# Altium schematic sheet Power_Circuit.SchDoc (part 2 of 3)
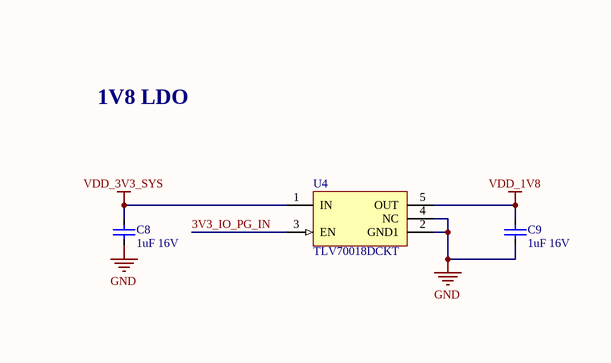
[diagram p2: Power_Circuit.SchDoc, right]
## Library data of the parts
C1 C8 C9 = 0603YD105KAT2A: 0603 1 uF 16 V ±10 % Tolerance X5R Surface Mount Multilayer Ceramic Capacitor; Manufacturer: Kyocera AVX; Tolerance: 10%; Dissipation Factor: 12.5%; Insulation Resistance: 10GR; Supplier 1: Digi-Key; Manufacturer Part Number: 0603YD105KAT2A; RoHS: Yes; Category: Ceramic Capacitors; Stock 1: 1533757; Pricing 1: 1=0.12000, 10=0.08200, 50=0.04660, 100=0.03870, 500=0.02710, 1000=0.02244 (USD); Mount: Surface Mount; Case/Package: 0603; Number of Pins: 2; Case Code (Metric): 1608; Case Code (Imperial): 0603; Min Operating Temperature: -55°C; Max Operating Temperature: 85°C; Capacitance: 1uF; Voltage Rating (DC): 16V; Packaging: Tape and Reel; Dielectric: X5R; Voltage: 16V; Voltage Rating: 16V; Package Quantity: 1; Termination: SMD/SMT; Series: -; Construction: Flat; Length: 1.6mm; Width: 0.032inch; Height: 0.9mm; Depth: 0.81mm; Thickness: 0.035inch; Radiation Hardening: No; Reach SVHC Compliant: Yes; Lead Free: Lead Free; RoHS Compliant: Yes; ComponentLink1URL: https://datasheet.ciiva.com/11788/0900766b80def1a5-11788563.pdf?src-supplier=RSComponents; ComponentLink1Description: https://datasheet.ciiva.com/11788/0900766b80def1a5-11788563.pdf?src-supplier=RSComponents; ComponentLink2URL: https://datasheet.ciiva.com/34303/2012654-34303835.pdf?src-supplier=Jameco; ComponentLink2Description: https://datasheet.ciiva.com/34303/2012654-34303835.pdf?src-supplier=Jameco; ComponentLink3URL: https://datasheet.ciiva.com/2987/cx5r-2987890.pdf?src-supplier=Avnet; ComponentLink3Description: https://datasheet.ciiva.com/2987/cx5r-2987890.pdf?src-supplier=Avnet; ComponentLink4URL: https://datasheet.ciiva.com/5412/cx5r-5412550.pdf?src-supplier=Mouser; ComponentLink4Description: https://datasheet.ciiva.com/5412/cx5r-5412550.pdf?src-supplier=Mouser; ComponentLink5URL: https://datasheet.ciiva.com/150/cx5r-150392.pdf?src-supplier=Digi-Key; ComponentLink5Description: https://datasheet.ciiva.com/150/cx5r-150392.pdf?src-supplier=Digi-Key; ComponentLink6URL: https://datasheet.ciiva.com/14590/70001028-14590632.pdf?src-supplier=Allied+Electronics; ComponentLink6Description: https://datasheet.ciiva.com/14590/70001028-14590632.pdf?src-supplier=Allied+Electronics; ComponentLink7URL: https://datasheet.ciiva.com/150/cx5r-150393.pdf?src-supplier=Digi-Key; ComponentLink7Description: https://datasheet.ciiva.com/150/cx5r-150393.pdf?src-supplier=Digi-Key; ComponentLink8URL: https://datasheet.ciiva.com/1458/84508-1458137.pdf?src-supplier=Element14; ComponentLink8Description: https://datasheet.ciiva.com/1458/84508-1458137.pdf?src-supplier=Element14; ComponentLink9URL: https://datasheet.ciiva.com/150/cx5r-150394.pdf?src-supplier=Digi-Key; ComponentLink9Description: https://datasheet.ciiva.com/150/cx5r-150394.pdf?src-supplier=Digi-Key; ComponentLink10URL: https://datasheet.ciiva.com/1458/84508-1458138.pdf?src-supplier=Element14; ComponentLink10Description: https://datasheet.ciiva.com/1458/84508-1458138.pdf?src-supplier=Element14; ComponentLink11URL: https://datasheet.ciiva.com/14586/70001028-14586715.pdf?src-supplier=Allied+Electronics; ComponentLink11Description: https://datasheet.ciiva.com/14586/70001028-14586715.pdf?src-supplier=Allied+Electronics; Supplier Part Number 1: 478-1249-1-ND
C2 C3 = UWT0J331MCL1GS: Aluminum Electrolytic Capacitor, 330uF 6.3 V, WT Series 1000h 6.3 (Dia.) x 7.7mm; Manufacturer: Nichicon; Dielectric Material: Aluminium; Tolerance: 20%; Life (Hours): 1000Hour; Ripple Current: 105mA; Leakage Current: 3uA; Dissipation Factor: 0.3%; Lead Diameter: 0.8mm; Supplier 1: Digi-Key; Manufacturer Part Number: UWT0J331MCL1GS; RoHS: Yes; Category: Aluminum Electrolytic Capacitors; Stock 1: 94061; Pricing 1: 1=0.51000, 10=0.35600, 50=0.24960, 100=0.21390 (USD); Mount: Surface Mount,PCB; Case/Package: Radial; Number of Pins: 2; Min Operating Temperature: -55°C; Max Operating Temperature: 105°C; Capacitance: 330uF; Voltage Rating: 6.3V; Packaging: Tape and Reel; Package Quantity: 1; Voltage Rating (DC): 6.3V; Termination: SMD/SMT; Voltage: 6.3V; Series: WT; Construction: Cylindrical; Diameter: 6.3mm; Length: 7.7mm; Height: 7.7mm; Height - Seated (Max): 0.303inch; Lead Pitch: 2.2mm; Radiation Hardening: No; Lead Free: Lead Free; RoHS Compliant: Yes; ComponentLink1URL: https://datasheet.ciiva.com/30522/getdatasheetpartid-427106-30522191.pdf?src-supplier=Verical; ComponentLink1Description: https://datasheet.ciiva.com/30522/getdatasheetpartid-427106-30522191.pdf?src-supplier=Verical; ComponentLink2URL: https://datasheet.ciiva.com/11781/0900766b80fa3a91-11781975.pdf?src-supplier=Rs; ComponentLink2Description: https://datasheet.ciiva.com/11781/0900766b80fa3a91-11781975.pdf?src-supplier=Rs; ComponentLink3URL: https://datasheet.ciiva.com/110/e-wt-110774.pdf?src-supplier=Digi-Key; ComponentLink3Description: https://datasheet.ciiva.com/110/e-wt-110774.pdf?src-supplier=Digi-Key; ComponentLink4URL: https://datasheet.ciiva.com/110/e-wt-110775.pdf?src-supplier=Digi-Key; ComponentLink4Description: https://datasheet.ciiva.com/110/e-wt-110775.pdf?src-supplier=Digi-Key; ComponentLink5URL: https://datasheet.ciiva.com/5363/e-wt-30307-5363479.pdf?src-supplier=Mouser; ComponentLink5Description: https://datasheet.ciiva.com/5363/e-wt-30307-5363479.pdf?src-supplier=Mouser; ComponentLink6URL: https://datasheet.ciiva.com/110/e-wt-110776.pdf?src-supplier=Digi-Key; ComponentLink6Description: https://datasheet.ciiva.com/110/e-wt-110776.pdf?src-supplier=Digi-Key; ComponentLink7URL: https://datasheet.ciiva.com/11687/e-wt-11687176.pdf?src-supplier=Avnet; ComponentLink7Description: https://datasheet.ciiva.com/11687/e-wt-11687176.pdf?src-supplier=Avnet; Supplier Part Number 1: 493-2157-1-ND
C4 = GRM188R61E475KE11D: 0603 4.7 uF 25 V ±10 % Tolerance X5R SMT Multilayer Ceramic Capacitor; Manufacturer: Murata; Tolerance: 10%; Supplier 1: Digi-Key; Manufacturer Part Number: GRM188R61E475KE11D; RoHS: Yes; Category: Ceramic Capacitors; Stock 1: 1144167; Pricing 1: 1=0.26000, 10=0.18000, 50=0.12000, 100=0.10200, 500=0.07202, 1000=0.06301 (USD); Mount: Surface Mount; Case/Package: 0603; Case Code (Metric): 1608; Case Code (Imperial): 0603; Material: Ceramic; Min Operating Temperature: -55°C; Max Operating Temperature: 85°C; Package Quantity: 1; Packaging: Cut Tape; Capacitance: 4.7uF; Voltage Rating: 25V; Dielectric: X5R; Voltage: 25V; Voltage Rating (DC): 25V; Series: GRM; Length: 0.063inch; Width: 0.031inch; Height: 0.8mm; Thickness: 0.031inch; Depth: 0.8mm; Reach SVHC Compliant: Yes; Lead Free: Lead Free; RoHS Compliant: Yes; ComponentLink1URL: https://datasheet.ciiva.com/46444/1769893-46444983.pdf?src-supplier=Element14; ComponentLink1Description: https://datasheet.ciiva.com/46444/1769893-46444983.pdf?src-supplier=Element14; ComponentLink2URL: https://datasheet.ciiva.com/46444/1769893-46444982.pdf?src-supplier=Element14; ComponentLink2Description: https://datasheet.ciiva.com/46444/1769893-46444982.pdf?src-supplier=Element14; ComponentLink3URL: https://datasheet.ciiva.com/14891/partnumbering-e-01-14891103.pdf?src-supplier=Digi-Key; ComponentLink3Description: https://datasheet.ciiva.com/14891/partnumbering-e-01-14891103.pdf?src-supplier=Digi-Key; ComponentLink4URL: https://datasheet.ciiva.com/14891/partnumbering-e-01-14891102.pdf?src-supplier=Digi-Key; ComponentLink4Description: https://datasheet.ciiva.com/14891/partnumbering-e-01-14891102.pdf?src-supplier=Digi-Key; Supplier Part Number 1: 490-7203-1-ND
C5 C7 = C0805C153G3GEC7210: Cap Cer 0805 15NF 25V C0G 2%; Manufacturer: KEMET; Supplier 1: DigiKey; Manufacturer Part Number: C0805C153G3GEC7210; Category: Ceramic Capacitors; Stock 1: 10000; Pricing 1: 10000=0.27568, 20000=0.27110, 30000=0.26528 (USD); RoHS Compliant: Yes; ComponentLink1URL: https://api.kemet.com/component-edge/download/datasheet/C0805C153G3GEC7210.pdf?src-supplier=Digi-Key; ComponentLink1Description: https://api.kemet.com/component-edge/download/datasheet/C0805C153G3GEC7210.pdf?src-supplier=Digi-Key; Supplier Part Number 1: 399-C0805C153G3GEC7210TR-ND
C6 C13 = 04023C104KAT2A: 0402 100 nF 25 V ±10 % Tolerance X7R Surface Mount Multilayer Ceramic Capacitor; Manufacturer: Kyocera AVX; Tolerance: 10%; Supplier 1: Digi-Key; Manufacturer Part Number: 04023C104KAT2A; RoHS: Yes; Category: Ceramic Capacitors; Stock 1: 3248475; Pricing 1: 1=0.10000, 10=0.03300, 50=0.01820, 100=0.01480, 500=0.01060, 1000=0.00833, 2500=0.00758, 5000=0.00697 (USD); Mount: Surface Mount; Case/Package: 0402; Number of Pins: 2; Case Code (Metric): 1005; Case Code (Imperial): 0402; Min Operating Temperature: -55°C; Max Operating Temperature: 125°C; Capacitance: 100nF; Packaging: Cut Tape; Dielectric: X7R; Voltage Rating (DC): 25V; Voltage Rating: 25V; Package Quantity: 1; Termination: SMD/SMT; Voltage: 25V; Series: -; Construction: Flat; Length: 1mm; Width: 1mm; Thickness: 0.022inch; Depth: 0.5mm; Radiation Hardening: No; Reach SVHC Compliant: Yes; Lead Free: Lead Free; RoHS Compliant: Yes; ComponentLink1URL: https://datasheet.ciiva.com/1123/1679506-1123344.pdf?src-supplier=Element14; ComponentLink1Description: https://datasheet.ciiva.com/1123/1679506-1123344.pdf?src-supplier=Element14; ComponentLink2URL: https://datasheet.ciiva.com/7614/cx7r-7614663.pdf?src-supplier=Digi-Key; ComponentLink2Description: https://datasheet.ciiva.com/7614/cx7r-7614663.pdf?src-supplier=Digi-Key; ComponentLink3URL: https://datasheet.ciiva.com/7709/1679506-7709527.pdf?src-supplier=Element14; ComponentLink3Description: https://datasheet.ciiva.com/7709/1679506-7709527.pdf?src-supplier=Element14; ComponentLink4URL: https://datasheet.ciiva.com/6265/cx7r-6265272.pdf?src-supplier=Digi-Key; ComponentLink4Description: https://datasheet.ciiva.com/6265/cx7r-6265272.pdf?src-supplier=Digi-Key; ComponentLink5URL: https://datasheet.ciiva.com/14906/cx7r-14906223.pdf?src-supplier=Digi-Key; ComponentLink5Description: https://datasheet.ciiva.com/14906/cx7r-14906223.pdf?src-supplier=Digi-Key; Supplier Part Number 1: 478-7868-1-ND
C10 C11 C19 = C0603C105K3PACTU: Cap Ceramic 1uF 25V X5R 10% SMD 0603 85°C Paper T/R; Manufacturer: KEMET; Supplier 1: Digi-Key; Manufacturer Part Number: C0603C105K3PACTU; RoHS: Yes; Category: Ceramic Capacitors; Stock 1: 254560; Pricing 1: 1=0.18000, 10=0.12900, 50=0.07320, 100=0.06060, 500=0.04252, 1000=0.03519 (USD); Mount: Surface Mount,PCB; Case/Package: 0603; Number of Pins: 2; Dielectric Material: Ceramic; Contact Plating: Tin,Matte; Case Code (Imperial): 0603; Case Code (Metric): 1608; Min Operating Temperature: -55°C; Max Operating Temperature: 85°C; Capacitance: 1uF; Tolerance: 10%; Packaging: Tape and Reel; Dielectric: X5R; Voltage Rating (DC): 25V; Voltage: 25V; Termination: SMD/SMT; Voltage Rating: 25V; Package Quantity: 4000; Series: SMD Comm X5R; Construction: Flat; Length: 1.6mm; Width: 0.031inch; Height: 0.8mm; Depth: 0.8mm; Thickness: 0.034inch; Radiation Hardening: No; Lead Free: Lead Free; Reach SVHC Compliant: Yes; RoHS Compliant: Yes; Supplier Part Number 1: 399-C0603C105K3PAC7867CT-ND
C12 = T494X107M025AT: Cap Tant Solid 100uF 25V X CASE 20% (7.3 X 4.3 X 4mm) SMD 7343-43 0.25 Ohm Embossed Plastic T/R; Manufacturer: KEMET; ESR (Equivalent Series Resistance): 250mR; Ripple Current: 812mA; Leakage Current: 25uA; Polarity: Polar; Dissipation Factor: 8%; Life (Hours): 2000Hour; Supplier 1: Digi-Key; Manufacturer Part Number: T494X107M025AT; RoHS: Yes; Category: Tantalum Capacitors; Stock 1: 6563; Pricing 1: 1=5.49000, 10=4.94500, 50=4.28600, 100=3.73640 (USD); Mount: Surface Mount; Case/Package: 2917; Case Code (Imperial): 2917; Case Code (Metric): 7343; Min Operating Temperature: -55°C; Max Operating Temperature: 125°C; Capacitance: 100uF; Package Quantity: 1; Voltage Rating: 25V; Tolerance: 20%; Packaging: Tape and Reel; Termination: SMD/SMT; Failure Rate: 0.001%; Voltage Rating (DC): 25V; Features: General Purpose; Series: T494; Construction: Flat; Length: 7.3mm; Width: 0.169inch; Height: 4.3mm; Height - Seated (Max): 0.169inch; Depth: 4.3mm; Radiation Hardening: No; Reach SVHC Compliant: Yes; RoHS Compliant: Yes; ComponentLink1URL: https://datasheet.ciiva.com/12882/255458-12882720.pdf?src-supplier=Mouser; ComponentLink1Description: https://datasheet.ciiva.com/12882/255458-12882720.pdf?src-supplier=Mouser; ComponentLink2URL: https://datasheet.ciiva.com/22690/1744550-22690484.pdf?src-supplier=Element14; ComponentLink2Description: https://datasheet.ciiva.com/22690/1744550-22690484.pdf?src-supplier=Element14; ComponentLink3URL: https://datasheet.ciiva.com/22690/1763363-22690485.pdf?src-supplier=Element14; ComponentLink3Description: https://datasheet.ciiva.com/22690/1763363-22690485.pdf?src-supplier=Element14; ComponentLink4URL: https://datasheet.ciiva.com/6247/kem-t2008-t494-6247254.pdf?src-supplier=Digi-Key; ComponentLink4Description: https://datasheet.ciiva.com/6247/kem-t2008-t494-6247254.pdf?src-supplier=Digi-Key; ComponentLink5URL: https://datasheet.ciiva.com/6247/kem-t2008-t494-6247257.pdf?src-supplier=Digi-Key; ComponentLink5Description: https://datasheet.ciiva.com/6247/kem-t2008-t494-6247257.pdf?src-supplier=Digi-Key; ComponentLink6URL: https://datasheet.ciiva.com/6247/kem-t2008-t494-6247258.pdf?src-supplier=Digi-Key; ComponentLink6Description: https://datasheet.ciiva.com/6247/kem-t2008-t494-6247258.pdf?src-supplier=Digi-Key; Supplier Part Number 1: 399-8485-6-ND
C14-C18 = CL21A226MPQNNNE: Cap Ceramic 22uF 10V X5R 20% SMD 0805 85°C Embossed Plastic T/R; Manufacturer: Samsung; Supplier 1: Digi-Key; Manufacturer Part Number: CL21A226MPQNNNE; RoHS: Yes; Category: Ceramic Capacitors; Stock 1: 362596; Pricing 1: 1=0.18000, 10=0.12800, 50=0.07260, 100=0.06010, 500=0.04218, 1000=0.03491 (USD); Mount: Surface Mount; Case/Package: 0805; Case Code (Metric): 2012; Case Code (Imperial): 0805; Min Operating Temperature: -55°C; Max Operating Temperature: 85°C; Package Quantity: 1; Packaging: Tape and Reel; Capacitance: 22uF; Tolerance: 20%; Voltage Rating: 10V; Voltage Rating (DC): 10V; Series: CL; Length: 0.079inch; Width: 0.049inch; Thickness: 0.053inch; Lead Free: Lead Free; RoHS Compliant: Yes; ComponentLink1URL: https://datasheet.ciiva.com/25721/cl21a226mpqnnne-25721488.pdf?src-supplier=Digi-Key; ComponentLink1Description: https://datasheet.ciiva.com/25721/cl21a226mpqnnne-25721488.pdf?src-supplier=Digi-Key; Supplier Part Number 1: 1276-2910-1-ND
C20 = CC0402JRNPO9BN330: 0402 33 pF 50 V ±5 % Tolerance NP0 SMT Multilayer Ceramic Capacitor; Manufacturer: Yageo; Tolerance: 5%; Dielectric: C0G; Insulation Resistance: 100GR; Supplier 1: Digi-Key; Manufacturer Part Number: CC0402JRNPO9BN330; RoHS: Yes; Category: Ceramic Capacitors; Stock 1: 1010765; Pricing 1: 1=0.10000, 10=0.01900, 50=0.01060, 100=0.00870, 500=0.00618, 1000=0.00486, 2500=0.00442, 5000=0.00407 (USD); Mount: Surface Mount; Case/Package: 0402; Number of Pins: 2; Case Code (Imperial): 0402; Case Code (Metric): 1005; Weight: 2.3E-05oz; Dielectric Material: Ceramic; Min Operating Temperature: -55°C; Max Operating Temperature: 125°C; Capacitance: 33pF; Voltage Rating: 50V; Packaging: Tape and Reel; Voltage Rating (DC): 50V; Package Quantity: 1; Termination: SMD/SMT; Resistor Type: Ceramic; Series: CC; Length: 1mm; Width: 0.02inch; Height: 0.5mm; Thickness: 0.022inch; Depth: 0.5mm; Radiation Hardening: No; Reach SVHC Compliant: Yes; Lead Free: Lead Free; RoHS Compliant: Yes; ComponentLink1URL: https://datasheet.ciiva.com/143/mlccorderingcode-143996.pdf?src-supplier=Digi-Key; ComponentLink1Description: https://datasheet.ciiva.com/143/mlccorderingcode-143996.pdf?src-supplier=Digi-Key; ComponentLink2URL: https://datasheet.ciiva.com/143/mlccorderingcode-143995.pdf?src-supplier=Digi-Key; ComponentLink2Description: https://datasheet.ciiva.com/143/mlccorderingcode-143995.pdf?src-supplier=Digi-Key; ComponentLink3URL: https://datasheet.ciiva.com/143/mlccorderingcode-143997.pdf?src-supplier=Digi-Key; ComponentLink3Description: https://datasheet.ciiva.com/143/mlccorderingcode-143997.pdf?src-supplier=Digi-Key; ComponentLink4URL: https://datasheet.ciiva.com/26862/getdatasheetpartid-403453-26862599.pdf?src-supplier=Verical; ComponentLink4Description: https://datasheet.ciiva.com/26862/getdatasheetpartid-403453-26862599.pdf?src-supplier=Verical; ComponentLink5URL: https://datasheet.ciiva.com/28450/1443161-28450254.pdf?src-supplier=Element14; ComponentLink5Description: https://datasheet.ciiva.com/28450/1443161-28450254.pdf?src-supplier=Element14; ComponentLink6URL: https://datasheet.ciiva.com/8033/1443161-8033611.pdf?src-supplier=Element14; ComponentLink6Description: https://datasheet.ciiva.com/8033/1443161-8033611.pdf?src-supplier=Element14; ComponentLink7URL: https://datasheet.ciiva.com/8033/1443161-8033610.pdf?src-supplier=Element14; ComponentLink7Description: https://datasheet.ciiva.com/8033/1443161-8033610.pdf?src-supplier=Element14; ComponentLink8URL: https://datasheet.ciiva.com/13263/upy-gp-np0-16v-to-50v-8-3714-13263802.pdf?src-supplier=Mouser; ComponentLink8Description: https://datasheet.ciiva.com/13263/upy-gp-np0-16v-to-50v-8-3714-13263802.pdf?src-supplier=Mouser; Supplier Part Number 1: 311-1020-1-ND
D1 = MSP5.0A-M3/89A: TVS DIODE 5VWM 13.4VC MICROSMP; Manufacturer: Vishay Semiconductors; Direction: Unidirectional; Operating Supply Voltage: 5V; Max Surge Current: 57A; Number of Elements: 1; Reverse Breakdown Voltage: 6.4V; Breakdown Voltage: 7.07V; Clamping Voltage: 14.5V; Peak Pulse Power: 150W; Power Line Protection: No; Max Reverse Leakage Current: 100uA; Test Current: 1mA; Power Dissipation: 100W; ESD Protection: Yes; Peak Pulse Current: 75A; Element Configuration: Single; Diode Type: ZENER; Clamping Voltage-Max: 9.2V; Supplier 1: Digi-Key; Manufacturer Part Number: MSP5.0A-M3/89A; RoHS: Yes; Category: TVS Diodes; Stock 1: 313268; Pricing 1: 1=0.40000, 10=0.33000, 100=0.17520, 500=0.11528, 1000=0.07839, 2000=0.07070 (USD); Mount: Surface Mount; Number of Pins: 2; Min Operating Temperature: -55°C; Max Operating Temperature: 150°C; Packaging: Tape and Reel; Package Quantity: 1; Number of Channels: 1; Polarity: Unidirectional; Termination: SMD/SMT; Number of Unidirectional Channels: 1; Reverse Standoff Voltage: 5V; Min Breakdown Voltage: 6.4V; Max Breakdown Voltage: 7.07V; Leakage Current: 100uA; Resistor Type: Zener; Series: TransZorb®, eSMP®; Length: 2.3mm; Width: 1.4mm; Height: 0.73mm; Radiation Hardening: No; Lead Free: Lead Free; RoHS Compliant: Yes; ComponentLink1URL: https://datasheet.ciiva.com/3023/msp3v3-3023073.pdf?src-supplier=Avnet; ComponentLink1Description: https://datasheet.ciiva.com/3023/msp3v3-3023073.pdf?src-supplier=Avnet; ComponentLink2URL: https://datasheet.ciiva.com/16464/msp3v3-16464165.pdf?src-supplier=Future+Electronics; ComponentLink2Description: https://datasheet.ciiva.com/16464/msp3v3-16464165.pdf?src-supplier=Future+Electronics; Supplier Part Number 1: MSP5.0A-M3/89AGICT-ND
D2 = YFZVFHTR2.2B: Zener Diode Single 2.315V 4% 120Ohm 500mW Automotive 2-Pin TUMD-M T/R; Manufacturer: Rohm; Zener Voltage: 2.2V; Supplier 1: Digi-Key; Manufacturer Part Number: YFZVFHTR2.2B; RoHS: Yes; Category: Zener Diodes; Stock 1: 2901; Pricing 1: 1=0.43000, 10=0.32700, 100=0.20350, 500=0.13926, 1000=0.10712 (USD); Number of Pins: 2; Max Operating Temperature: 150°C; Max Power Dissipation: 500mW; Packaging: Cut Tape; Reach SVHC Compliant: Yes; RoHS Compliant: Yes; ComponentLink1URL: http://www.farnell.com/datasheets/2064408.pdf?src-supplier=Element14; ComponentLink1Description: http://www.farnell.com/datasheets/2064408.pdf?src-supplier=Element14; ComponentLink2URL: http://www.farnell.com/datasheets/2064412.pdf?src-supplier=Element14; ComponentLink2Description: http://www.farnell.com/datasheets/2064412.pdf?src-supplier=Element14; ComponentLink3URL: http://rohmfs.rohm.com/en/products/databook/datasheet/discrete/diode/zener/yfzvfhtr2.2b-e.pdf?src-supplier=Digi-Key; ComponentLink3Description: http://rohmfs.rohm.com/en/products/databook/datasheet/discrete/diode/zener/yfzvfhtr2.2b-e.pdf?src-supplier=Digi-Key; Supplier Part Number 1: YFZVFHTR2.2BCT-ND
D3 = BAT54CW-7-F: DIODE ARRAY SCHOTTKY 30V SOT323; Manufacturer: Diodes; Element Configuration: Common Cathode; Forward Current: 200mA; Reverse Recovery Time: 5ns; Peak Non-Repetitive Surge Current: 600mA; Forward Voltage: 1V; Max Reverse Current: 2uA; Capacitance: 10pF; Max Power Dissipation: 200mW; Supplier 1: Mouser; Manufacturer Part Number: BAT54CW-7-F; RoHS: Yes; Category: Schottky Diodes; Stock 1: 101542; Pricing 1: 1=0.25000, 10=0.21000, 50=0.21000, 100=0.11200, 500=0.07400, 1000=0.05000, 3000=0.04400, 9000=0.03300, 10000=0.03300, 24000=0.03100, 45000=0.02900 (USD); Mount: Surface Mount; Case/Package: SOT-323; Number of Pins: 3; Contact Plating: Tin,Matte; Weight: 0.000212oz; Min Operating Temperature: -65°C; Max Operating Temperature: 125°C; Package Quantity: 3000; Packaging: Tape and Reel; Max Repetitive Reverse Voltage (Vrrm): 30V; Average Rectified Current: 200mA; Max Forward Surge Current (Ifsm): 600mA; Max Reverse Voltage (DC): 30V; Series: -; Current Rating: 200mA; Voltage Rating (DC): 30V; Power Dissipation: 200mW; Termination: SMD/SMT; Power Rating: 200mW; Length: 2.2mm; Width: 1.35mm; Height: 1mm; Radiation Hardening: No; RoHS Compliant: Yes; Lead Free: Lead Free; ComponentLink1URL: https://datasheet.ciiva.com/4715/ds30065-16178-4715568.pdf?src-supplier=Mouser; ComponentLink1Description: https://datasheet.ciiva.com/4715/ds30065-16178-4715568.pdf?src-supplier=Mouser; ComponentLink2URL: https://datasheet.ciiva.com/8300/ds30065-8300679.pdf?src-supplier=Avnet; ComponentLink2Description: https://datasheet.ciiva.com/8300/ds30065-8300679.pdf?src-supplier=Avnet; ComponentLink3URL: https://datasheet.ciiva.com/8300/ds30065-8300684.pdf?src-supplier=Avnet; ComponentLink3Description: https://datasheet.ciiva.com/8300/ds30065-8300684.pdf?src-supplier=Avnet; Supplier Part Number 1: 621-BAT54CW-F
D4 = NZ9F5V1ST5G: 250 mW Zener Diode Voltage Regulator Tight Tolerance 5.1 V; Manufacturer: ON Semiconductor; Max Power Dissipation: 200mW; Tolerance: 2%; Max Reverse Leakage Current: 2uA; Impedance: 80R; Zener Voltage: 5.0945V; Test Current: 5mA; Element Configuration: Single; Supplier 1: Digi-Key; Manufacturer Part Number: NZ9F5V1ST5G; RoHS: Yes; Category: Zener Diodes; Stock 1: 29030; Pricing 1: 1=0.40000, 10=0.32600, 100=0.17280, 500=0.11368, 1000=0.07731, 2000=0.06973 (USD); Case/Package: SOD-923-2; Number of Pins: 2; Min Operating Temperature: -65°C; Max Operating Temperature: 150°C; Package Quantity: 8000; Packaging: Tape and Reel; Power Dissipation: 200mW; Voltage Tolerance: 2%; Radiation Hardening: No; Reach SVHC Compliant: Yes; Lead Free: Lead Free; RoHS Compliant: Yes; ComponentLink1URL: https://datasheet.ciiva.com/900/nz9f2v4s-d-900348.pdf?src-supplier=Digi-Key; ComponentLink1Description: https://datasheet.ciiva.com/900/nz9f2v4s-d-900348.pdf?src-supplier=Digi-Key; ComponentLink2URL: https://datasheet.ciiva.com/10638/nz9f2v4s-d-10638860.pdf?src-supplier=Avnet; ComponentLink2Description: https://datasheet.ciiva.com/10638/nz9f2v4s-d-10638860.pdf?src-supplier=Avnet; Supplier Part Number 1: NZ9F5V1ST5GOSCT-ND
D5 = TPD1E10B06QDPYRQ1: Automotive 12-pF, ±5.5V ±30-kV ESD protection diode in 0402 Package 2-X1SON -40 to 125; Manufacturer: Texas Instruments; Capacitance: 12pF; Number of Channels: 1; Supplier 1: Mouser; Manufacturer Part Number: TPD1E10B06QDPYRQ1; RoHS: Yes; Category: TVS Diodes; Stock 1: 130973; Pricing 1: 1=0.46000, 10=0.34900, 50=0.34900, 100=0.21800, 1000=0.11500, 10000=0.08800 (USD); Case/Package: 0402; Number of Pins: 2; Min Operating Temperature: -40°C; Max Operating Temperature: 125°C; Lead Free: Lead Free; RoHS Compliant: Yes; ComponentLink1URL: http://www.ti.com/lit/ds/symlink/tpd1e10b06-q1.pdf?src-supplier=Digi-Key; ComponentLink1Description: http://www.ti.com/lit/ds/symlink/tpd1e10b06-q1.pdf?src-supplier=Digi-Key; ComponentLink2URL: http://www.ti.com/general/docs/suppproductinfo.tsp?distId=10&amp;gotoUrl=http%3A%2F%2Fwww.ti.com%2Flit%2Fgpn%2Ftpd1e10b06-q1&src-supplier=Digi-Key; ComponentLink2Description: http://www.ti.com/general/docs/suppproductinfo.tsp?distId=10&amp;gotoUrl=http%3A%2F%2Fwww.ti.com%2Flit%2Fgpn%2Ftpd1e10b06-q1&src-supplier=Digi-Key; Supplier Part Number 1: 595-PD1E10B06QDPYRQ1
J1 = DCJ200-10-A-K1-K: DCJ200 Series 20 V 5 A Horizontal PCB Mount Jack Power Jack; Manufacturer: Global Connector Technology; Voltage Rating (DC): 20V; Gender: Male; Current Rating: 5A; Supplier 1: Farnell; Manufacturer Part Number: DCJ200-10-A-K1-K; RoHS: Yes; Category: Connectors; Stock 1: 12106; Pricing 1: 10=0.52700, 50=0.49600, 100=0.47400, 250=0.43100, 500=0.38800, 1500=0.34500 (GBP); Termination: Through Hole; Voltage Rating: 20V; ComponentLink1URL: http://www.farnell.com/datasheets/2342921.pdf?src-supplier=Farnell; ComponentLink1Description: http://www.farnell.com/datasheets/2342921.pdf?src-supplier=Farnell; Supplier Part Number 1: 2673246
J2 = 39544-3002: 5.08mm Pitch Eurostyle Vertical Fixed Mount PCB Terminal Block, 2 Circuits; Manufacturer: Molex; Voltage Rating: 300V; Current Rating: 15A; Number of Positions: 2; Wire Gauge (Max): 12AWG; Wire Gauge (Min): 22AWG; Supplier 1: Mouser; Manufacturer Part Number: 39544-3002; RoHS: Yes; Category: Terminal Blocks; Stock 1: 5531; Pricing 1: 1=1.06000, 10=0.71200, 50=0.71200, 100=0.69100, 1000=0.53300, 10000=0.47100 (USD); Mount: Through Hole; Contact Material: Brass; Contact Plating: Tin; Weight: 0.099473oz; Housing Color: Black; Housing Material: Polyamide; Min Operating Temperature: -40°C; Max Operating Temperature: 105°C; Package Quantity: 1440; Number of Rows: 1; Max Supply Voltage: 300V; Packaging: Bulk; Number of Contacts: 2; Number of Circuits: 2; Termination: Solder; Orientation: Vertical; Series: 39544; Length: 10.16mm; Height: 14.4mm; Wire/Cable Gauge: 22AWG; Pitch: 5.08mm; Depth: 10mm; Halogen Free: Low Halogen; Lead Free: Lead Free; Flammability Rating: UL94 V-0; ComponentLink1URL: https://datasheet.ciiva.com/5186/0395443002-terminal-blocks-167587-5186614.pdf?src-supplier=Mouser; ComponentLink1Description: https://datasheet.ciiva.com/5186/0395443002-terminal-blocks-167587-5186614.pdf?src-supplier=Mouser; Supplier Part Number 1: 538-39544-3002
L1 = NRS8030T2R2NJGJ: Inductor Power Shielded Wirewound 2.2uH 30% 100KHz Ferrite 4.8A 0.0195Ohm DCR 3131 T/R; Manufacturer: Taiyo Yuden; Self Resonant Frequency: 60MHz; Saturation Current: 4.9A; DC Resistance (DCR): 19.5mR; Supplier 1: Digi-Key; Manufacturer Part Number: NRS8030T2R2NJGJ; RoHS: Yes; Category: Fixed Inductors; Stock 1: 101559; Pricing 1: 1=0.45000, 10=0.39600, 25=0.36760, 50=0.31100, 100=0.28280, 250=0.26584, 500=0.23756 (USD); Mount: Surface Mount; Case/Package: Nonstandard; Number of Pins: 2; Core Material: Ferrite; Min Operating Temperature: -25°C; Max Operating Temperature: 125°C; Packaging: Cut Tape; Tolerance: 30%; Package Quantity: 1000; Current Rating: 4.8A; Shielding: Shielded; Inductance: 2.2uH; Inductance Tolerance: 30%; Max DC Current: 4.9A; Termination: SMD/SMT; Resistor Type: Wirewound; Test Frequency: 100kHz; RMS Current (Irms): 4.8A; Series: NRS; Length: 8mm; Width: 0.315inch; Height: 3mm; Height - Seated (Max): 0.118inch; Depth: 8.2mm; Lead Pitch: 5.6mm; Radiation Hardening: No; Lead Free: Lead Free; Halogen Free: Halogen Free; RoHS Compliant: Yes; ComponentLink1URL: https://datasheet.ciiva.com/6699/nrs8030t2r2njgj-ss-6699093.pdf?src-supplier=Digi-Key; ComponentLink1Description: https://datasheet.ciiva.com/6699/nrs8030t2r2njgj-ss-6699093.pdf?src-supplier=Digi-Key; ComponentLink2URL: https://datasheet.ciiva.com/8504/nrs8030t2r2njgj-ss-8504418.pdf?src-supplier=Avnet; ComponentLink2Description: https://datasheet.ciiva.com/8504/nrs8030t2r2njgj-ss-8504418.pdf?src-supplier=Avnet; ComponentLink3URL: https://datasheet.ciiva.com/25607/0900766b810b3cd2-25607146.pdf?src-supplier=Rs; ComponentLink3Description: https://datasheet.ciiva.com/25607/0900766b810b3cd2-25607146.pdf?src-supplier=Rs; Supplier Part Number 1: 587-2965-1-ND
L2 = ASPI-4030S-1R5N-T: Inductor Power Shielded Wirewound 1.5uH 30% 100KHz Ferrite 3.34A 0.02Ohm DCR 1515 T/R; Manufacturer: Abracon; DC Resistance (DCR): 20mR; Max DC Current: 4.84A; Self Resonant Frequency: 62MHz; Supplier 1: Digi-Key; Manufacturer Part Number: ASPI-4030S-1R5N-T; RoHS: Yes; Category: Fixed Inductors; Stock 1: 42398; Pricing 1: 1=0.45000, 10=0.39700, 25=0.36840, 50=0.31160, 100=0.28320, 250=0.26624, 500=0.23792, 1000=0.19261 (USD); Mount: Surface Mount; Case/Package: Nonstandard; Core Material: Ferrite; Min Operating Temperature: -40°C; Max Operating Temperature: 125°C; Resistor Type: Wirewound; Inductance: 1.5uH; Test Frequency: 100kHz; Termination: SMD/SMT; Tolerance: 30%; Current Rating: 3.34A; Saturation Current: 4.84A; Shielding: Shielded; Packaging: Tape and Reel; Package Quantity: 2000; Length: 0.157inch; Width: 0.157inch; Height: 3mm; Height - Seated (Max): 0.118inch; Lead Free: Lead Free; ComponentLink1URL: https://datasheet.ciiva.com/18688/aspi-4030s-18688101.pdf?src-supplier=Digi-Key; ComponentLink1Description: https://datasheet.ciiva.com/18688/aspi-4030s-18688101.pdf?src-supplier=Digi-Key; Supplier Part Number 1: 535-12317-1-ND
Q1 = DMN26D0UFB4-7: Single N-Channel 20 V 350 mW Silicon Surface Mount Mosfet - DFN-3; Manufacturer: Diodes; Rise Time: 7.9ns; Rds On Max: 3R; Input Capacitance: 14.1pF; Continuous Drain Current (ID): 240mA; Drain to Source Resistance: 1.8R; Power Dissipation: 350mW; Turn-Off Delay Time: 13.4ns; Drain to Source Voltage (Vdss): 20V; Turn-On Delay Time: 3.8ns; Fall Time: 15.2ns; Number of Elements: 1; Gate to Source Voltage (Vgs): 10V; On-State Resistance: 10R; FET Type: 1 N-Channel; Supplier 1: Mouser; Manufacturer Part Number: DMN26D0UFB4-7; RoHS: Yes; Category: MOSFETs; Stock 1: 21043; Pricing 1: 1=0.38000, 10=0.32100, 50=0.32100, 100=0.17000, 1000=0.07700, 10000=0.05000 (USD); Mount: Surface Mount; Case/Package: DFN; Number of Pins: 3; Min Operating Temperature: -55°C; Max Operating Temperature: 150°C; Packaging: Tape and Reel; Package Quantity: 3000; Max Power Dissipation: 350mW; Element Configuration: Single; Number of Channels: 1; Polarity: N-CHANNEL; Series: -; Drain-source On Resistance-Max: 10R; Length: 1.05mm; Width: 0.65mm; Height: 0.35mm; Radiation Hardening: No; Reach SVHC Compliant: Yes; Lead Free: Lead Free; RoHS Compliant: Yes; ComponentLink1URL: https://datasheet.ciiva.com/4443/ds31775-89139-4443083.pdf?src-supplier=Mouser; ComponentLink1Description: https://datasheet.ciiva.com/4443/ds31775-89139-4443083.pdf?src-supplier=Mouser; ComponentLink2URL: https://datasheet.ciiva.com/11176/ds31775-11176556.pdf?src-supplier=Avnet; ComponentLink2Description: https://datasheet.ciiva.com/11176/ds31775-11176556.pdf?src-supplier=Avnet; ComponentLink3URL: https://datasheet.ciiva.com/16434/ds31775-16434037.pdf?src-supplier=Future+Electronics; ComponentLink3Description: https://datasheet.ciiva.com/16434/ds31775-16434037.pdf?src-supplier=Future+Electronics; ComponentLink4URL: https://datasheet.ciiva.com/48532/ds31775-48532486.pdf?src-supplier=Avnet; ComponentLink4Description: https://datasheet.ciiva.com/48532/ds31775-48532486.pdf?src-supplier=Avnet; ComponentLink5URL: https://datasheet.ciiva.com/934/ds31775-934573.pdf?src-supplier=Digi-Key; ComponentLink5Description: https://datasheet.ciiva.com/934/ds31775-934573.pdf?src-supplier=Digi-Key; ComponentLink6URL: https://datasheet.ciiva.com/934/ds31775-934574.pdf?src-supplier=Digi-Key; ComponentLink6Description: https://datasheet.ciiva.com/934/ds31775-934574.pdf?src-supplier=Digi-Key; ComponentLink7URL: https://datasheet.ciiva.com/934/ds31775-934572.pdf?src-supplier=Digi-Key; ComponentLink7Description: https://datasheet.ciiva.com/934/ds31775-934572.pdf?src-supplier=Digi-Key; Supplier Part Number 1: 621-DMN26D0UFB4-7
R1 R2 R13 R15 = RC0402FR-07110KL: Res General Purpose Thick Film 0402 110K Ohm 1% 1/16W ±100ppm/°C Molded SMD Paper T/R; Manufacturer: Yageo; Resistance: 110kR; Power Rating: 63mW; Voltage Rating: 50V; Supplier 1: Digi-Key; Manufacturer Part Number: RC0402FR-07110KL; RoHS: Yes; Category: Chip SMD Resistors; Stock 1: 804724; Pricing 1: 1=0.10000, 10=0.01400, 100=0.00580, 1000=0.00262, 2500=0.00228, 5000=0.00188 (USD); Case/Package: 0402; Case Code (Imperial): 0402; Case Code (Metric): 1005; Min Operating Temperature: -55°C; Max Operating Temperature: 155°C; Tolerance: 1%; Packaging: Tape and Reel; Termination: SMD/SMT; Resistor Type: Thick Film; Temperature Coefficient: 100ppm/°C; Voltage Rating (DC): 50V; Number of Terminations: 2; Features: Moisture Resistant; Series: RC; Max Power Dissipation: 63mW; Construction: Rectangular; Resistance Tolerance: 1%; Working Voltage: 50V; Technology: THICK FILM; Length: 1mm; Depth: 0.5mm; Military Standard: Not; Lead Free: Lead Free; RoHS Compliant: Yes; ComponentLink1URL: http://www.farnell.com/datasheets/2167052.pdf?src-supplier=Farnell; ComponentLink1Description: http://www.farnell.com/datasheets/2167052.pdf?src-supplier=Farnell; Supplier Part Number 1: 311-110KLRCT-ND
R3 = RC0402JR-075R6L: Res Thick Film 0402 5.6 Ohm 5% 1/16W ±200ppm/°C Molded SMD Paper T/R; Manufacturer: Yageo; Power Rating: 62.5mW; Voltage Rating: 50V; Max Power Dissipation: 63mW; Supplier 1: Digi-Key; Manufacturer Part Number: RC0402JR-075R6L; RoHS: Yes; Category: Chip SMD Resistors; Stock 1: 729483; Pricing 1: 1=0.10000, 10=0.01700, 100=0.00690, 1000=0.00310, 2500=0.00270, 5000=0.00223 (USD); Case/Package: 0402; Number of Pins: 2; Case Code (Metric): 1005; Case Code (Imperial): 0402; Contact Plating: Tin,Matte; Min Operating Temperature: -55°C; Max Operating Temperature: 155°C; Resistance: 5.6R; Tolerance: 5%; Package Quantity: 10000; Packaging: Tape and Reel; Resistor Type: Thick Film; Number of Terminations: 2; Termination: SMD/SMT; Temperature Coefficient: 200ppm/°C; Features: Moisture Resistant; Series: RC; Resistance Tolerance: 5%; Construction: Rectangular; Voltage Rating (DC): 50V; Working Voltage: 50V; Technology: THICK FILM; Length: 0.039inch; Width: 0.02inch; Height: 0.016inch; Depth: 0.5mm; Reach SVHC Compliant: Yes; Military Standard: Not; Lead Free: Lead Free; RoHS Compliant: Yes; ComponentLink1URL: https://datasheet.ciiva.com/2452/pyu-r-int-thick-7-2452711.pdf?src-supplier=Digi-Key; ComponentLink1Description: https://datasheet.ciiva.com/2452/pyu-r-int-thick-7-2452711.pdf?src-supplier=Digi-Key; ComponentLink2URL: https://datasheet.ciiva.com/2452/pyu-r-int-thick-7-2452712.pdf?src-supplier=Digi-Key; ComponentLink2Description: https://datasheet.ciiva.com/2452/pyu-r-int-thick-7-2452712.pdf?src-supplier=Digi-Key; ComponentLink3URL: https://datasheet.ciiva.com/2452/pyu-r-int-thick-7-2452710.pdf?src-supplier=Digi-Key; ComponentLink3Description: https://datasheet.ciiva.com/2452/pyu-r-int-thick-7-2452710.pdf?src-supplier=Digi-Key; ComponentLink4URL: https://datasheet.ciiva.com/8892/pyu-rc0402-51-rohs-l-6-8892550.pdf?src-supplier=Avnet; ComponentLink4Description: https://datasheet.ciiva.com/8892/pyu-rc0402-51-rohs-l-6-8892550.pdf?src-supplier=Avnet; ComponentLink5URL: https://datasheet.ciiva.com/16744/pyu-rc0402-51-rohs-l-6-r-16744231.pdf?src-supplier=Future+Electronics; ComponentLink5Description: https://datasheet.ciiva.com/16744/pyu-rc0402-51-rohs-l-6-r-16744231.pdf?src-supplier=Future+Electronics; Supplier Part Number 1: 311-5.6JRCT-ND
R4 R16 = RC0402FR-078K45L: Res Thick Film 0402 8.45K Ohm 1% 1/16W ±100ppm/°C Molded SMD Paper T/R; Manufacturer: Yageo; Resistance: 8.45kR; Power Rating: 62.5mW; Voltage Rating: 50V; Max Power Dissipation: 63mW; Supplier 1: Digi-Key; Manufacturer Part Number: RC0402FR-078K45L; RoHS: Yes; Category: Chip SMD Resistors; Stock 1: 246158; Pricing 1: 1=0.10000, 10=0.01400, 100=0.00580, 1000=0.00262, 2500=0.00228, 5000=0.00188 (USD); Case/Package: 0402; Case Code (Imperial): 0402; Case Code (Metric): 1005; Contact Plating: Tin,Matte; Size Code: 0402; Min Operating Temperature: -55°C; Max Operating Temperature: 155°C; Packaging: Tape and Reel; Tolerance: 1%; Package Quantity: 10000; Resistor Type: Thick Film; Number of Terminations: 2; Termination: SMD/SMT; Temperature Coefficient: 100ppm/°C; Features: Moisture Resistant; Series: RC; Construction: Rectangular; Length: 1mm; Width: 0.02inch; Height: 0.016inch; Depth: 0.5mm; Military Standard: Not; Lead Free: Lead Free; RoHS Compliant: Yes; ComponentLink1URL: https://datasheet.ciiva.com/5596/pyu-rc0402-51-rohs-l-6-r-8721-5596030.pdf?src-supplier=Mouser; ComponentLink1Description: https://datasheet.ciiva.com/5596/pyu-rc0402-51-rohs-l-6-r-8721-5596030.pdf?src-supplier=Mouser; ComponentLink2URL: https://datasheet.ciiva.com/17044/pyu-rc0402-51-rohs-l-6-r-17044351.pdf?src-supplier=Future+Electronics; ComponentLink2Description: https://datasheet.ciiva.com/17044/pyu-rc0402-51-rohs-l-6-r-17044351.pdf?src-supplier=Future+Electronics; Supplier Part Number 1: YAG3254CT-ND
R5 R11 R14 = RC0402FR-0710KP: Res General Purpose Thick Film 0402 10K Ohm 1% 1/16W ±100ppm/°C Molded SMD Paper T/R; Manufacturer: Yageo; Resistance: 10kR; Max Power Dissipation: 63mW; Temperature Coefficient: 150ppm/°C; Supplier 1: Digi-Key; Manufacturer Part Number: RC0402FR-0710KP; RoHS: Yes; Category: Chip SMD Resistors; Stock 1: 1032587; Pricing 1: 1=0.10000, 10=0.03100, 100=0.01280, 1000=0.00573, 2500=0.00497, 5000=0.00411 (USD); Case/Package: 0402; Case Code (Metric): 1005; Case Code (Imperial): 0402; Min Operating Temperature: -55°C; Max Operating Temperature: 155°C; Packaging: Tape and Reel; Resistor Type: Thick Film; Number of Terminations: 2; Tolerance: 1%; Features: Moisture Resistant; Length: 0.039inch; Width: 0.02inch; Height: 0.016inch; RoHS Compliant: Yes; ComponentLink1URL: http://www.yageo.com/NewPortal/yageodocoutput?fileName=/pdf/R-Chip/PYu-RC_51_RoHS_P_0.pdf&src-supplier=Digi-Key; ComponentLink1Description: http://www.yageo.com/NewPortal/yageodocoutput?fileName=/pdf/R-Chip/PYu-RC_51_RoHS_P_0.pdf&src-supplier=Digi-Key; Supplier Part Number 1: YAG1249CT-ND
R6 R17 = RC0402FR-0724K9L: Res Thick Film 0402 24.9K Ohm 1% 1/16W ±100ppm/°C Molded SMD Paper T/R; Manufacturer: Yageo; Resistance: 24.9kR; Power Rating: 62.5mW; Voltage Rating: 50V; Max Power Dissipation: 63mW; Supplier 1: Mouser; Manufacturer Part Number: RC0402FR-0724K9L; RoHS: Yes; Category: Chip SMD Resistors; Stock 1: 1202856; Pricing 1: 1=0.10000, 10=0.01600, 50=0.01600, 100=0.00700, 1000=0.00300, 10000=0.00100 (USD); Case/Package: 0402; Case Code (Metric): 1005; Case Code (Imperial): 0402; Contact Plating: Tin,Matte; Size Code: 0402; Min Operating Temperature: -55°C; Max Operating Temperature: 155°C; Tolerance: 1%; Package Quantity: 1; Packaging: Tape and Reel; Resistor Type: Thick Film; Number of Terminations: 2; Termination: SMD/SMT; Temperature Coefficient: 100ppm/°C; Voltage Rating (DC): 50V; Features: Moisture Resistant; Series: RC; Construction: Rectangular; Length: 1mm; Width: 0.02inch; Height: 0.016inch; Depth: 0.5mm; Military Standard: Not; Lead Free: Lead Free; RoHS Compliant: Yes; ComponentLink1URL: https://datasheet.ciiva.com/2519/pyu-r-int-thick-7-2519127.pdf?src-supplier=Digi-Key; ComponentLink1Description: https://datasheet.ciiva.com/2519/pyu-r-int-thick-7-2519127.pdf?src-supplier=Digi-Key; ComponentLink2URL: https://datasheet.ciiva.com/2519/pyu-r-int-thick-7-2519128.pdf?src-supplier=Digi-Key; ComponentLink2Description: https://datasheet.ciiva.com/2519/pyu-r-int-thick-7-2519128.pdf?src-supplier=Digi-Key; ComponentLink3URL: https://datasheet.ciiva.com/2519/pyu-r-int-thick-7-2519126.pdf?src-supplier=Digi-Key; ComponentLink3Description: https://datasheet.ciiva.com/2519/pyu-r-int-thick-7-2519126.pdf?src-supplier=Digi-Key; ComponentLink4URL: https://datasheet.ciiva.com/12667/pyu-rc0402-51-rohs-l-6-r-12667961.pdf?src-supplier=Mouser; ComponentLink4Description: https://datasheet.ciiva.com/12667/pyu-rc0402-51-rohs-l-6-r-12667961.pdf?src-supplier=Mouser; ComponentLink5URL: https://datasheet.ciiva.com/8889/pyu-rc0402-51-rohs-l-6-8889995.pdf?src-supplier=Avnet; ComponentLink5Description: https://datasheet.ciiva.com/8889/pyu-rc0402-51-rohs-l-6-8889995.pdf?src-supplier=Avnet; ComponentLink6URL: https://datasheet.ciiva.com/17019/pyu-rc0402-51-rohs-l-6-r-17019690.pdf?src-supplier=Future+Electronics; ComponentLink6Description: https://datasheet.ciiva.com/17019/pyu-rc0402-51-rohs-l-6-r-17019690.pdf?src-supplier=Future+Electronics; Supplier Part Number 1: 603-RC0402FR-0724K9L
R7 R12 R18 R21 R22 R24-R26 R28 = CR0603-J/-000ELF: RES SMD 0 OHM JUMPER 1/10W 0603; Manufacturer: Bourns; Resistance: 0mR; Power Rating: 100mW; Tolerance: 1%; Voltage Rating: 50V; Temperature Coefficient: 500ppm/°C; Resistance Tolerance: 5%; Supplier 1: Digi-Key; Manufacturer Part Number: CR0603-J/-000ELF; RoHS: Yes; Category: Chip SMD Resistors; Stock 1: 1690954; Pricing 1: 1=0.10000, 10=0.01300, 25=0.00960, 50=0.00720, 100=0.00540, 250=0.00408, 500=0.00328, 1000=0.00241 (USD); Mount: Surface Mount; Case/Package: 0603; Number of Pins: 2; Case Code (Imperial): 0603; Case Code (Metric): 1608; Contact Plating: Tin; Min Operating Temperature: -55°C; Max Operating Temperature: 155°C; Packaging: Tape and Reel; Package Quantity: 5000; Resistor Type: Thick Film; Termination: SMD/SMT; Max Power Dissipation: 100mW; Voltage Rating (DC): 50V; Series: CR0603; Technology: THICK FILM; Construction: Rectangular; Features: Moisture Resistant; Number of Terminations: 2; Length: 1.6mm; Width: 0.8mm; Height: 0.45mm; Depth: 0.8mm; Thickness: 457um; Radiation Hardening: No; Reach SVHC Compliant: Yes; Military Standard: Not; RoHS Compliant: Yes; ComponentLink1URL: https://datasheet.ciiva.com/11809/0900766b80fcdb72-11809586.pdf?src-supplier=RSComponents; ComponentLink1Description: https://datasheet.ciiva.com/11809/0900766b80fcdb72-11809586.pdf?src-supplier=RSComponents; ComponentLink2URL: https://datasheet.ciiva.com/7001/1902866-7001645.pdf?src-supplier=Newark; ComponentLink2Description: https://datasheet.ciiva.com/7001/1902866-7001645.pdf?src-supplier=Newark; ComponentLink3URL: https://datasheet.ciiva.com/7986/691949-7986171.pdf?src-supplier=Element14; ComponentLink3Description: https://datasheet.ciiva.com/7986/691949-7986171.pdf?src-supplier=Element14; ComponentLink4URL: https://datasheet.ciiva.com/7660/1856384-7660956.pdf?src-supplier=Element14; ComponentLink4Description: https://datasheet.ciiva.com/7660/1856384-7660956.pdf?src-supplier=Element14; ComponentLink5URL: https://datasheet.ciiva.com/22693/1902866-22693213.pdf?src-supplier=Element14; ComponentLink5Description: https://datasheet.ciiva.com/22693/1902866-22693213.pdf?src-supplier=Element14; ComponentLink6URL: https://datasheet.ciiva.com/5545/chpreztr-5545708.pdf?src-supplier=Mouser; ComponentLink6Description: https://datasheet.ciiva.com/5545/chpreztr-5545708.pdf?src-supplier=Mouser; ComponentLink7URL: https://datasheet.ciiva.com/16761/70154685-16761515.pdf?src-supplier=Allied+Electronics; ComponentLink7Description: https://datasheet.ciiva.com/16761/70154685-16761515.pdf?src-supplier=Allied+Electronics; ComponentLink8URL: https://datasheet.ciiva.com/30062/159chpreztr-30062601.pdf?src-supplier=Onlinecomponents.com; ComponentLink8Description: https://datasheet.ciiva.com/30062/159chpreztr-30062601.pdf?src-supplier=Onlinecomponents.com; ComponentLink9URL: https://datasheet.ciiva.com/48692/001055497-da-01-en-smd-wid-cr0603-j-000elf-0-0-ohm-1-10w-48692135.pdf?src-supplier=Conrad; ComponentLink9Description: https://datasheet.ciiva.com/48692/001055497-da-01-en-smd-wid-cr0603-j-000elf-0-0-ohm-1-10w-48692135.pdf?src-supplier=Conrad; Supplier Part Number 1: CR0603-J/-000ELFCT-ND
R8 = RC0402FR-0716K9L: Res Thick Film 0402 16.9K Ohm 1% 1/16W ±100ppm/°C Molded SMD Paper T/R; Manufacturer: Yageo; Resistance: 16.9kR; Voltage Rating: 50V; Power Rating: 62.5mW; Max Power Dissipation: 63mW; Supplier 1: Digi-Key; Manufacturer Part Number: RC0402FR-0716K9L; RoHS: Yes; Category: Chip SMD Resistors; Stock 1: 1100238; Pricing 1: 1=0.10000, 10=0.01400, 100=0.00580, 1000=0.00262, 2500=0.00228, 5000=0.00188 (USD); Case/Package: 0402; Case Code (Imperial): 0402; Case Code (Metric): 1005; Contact Plating: Tin,Matte; Size Code: 0402; Min Operating Temperature: -55°C; Max Operating Temperature: 155°C; Package Quantity: 10000; Tolerance: 1%; Packaging: Tape and Reel; Resistor Type: Thick Film; Number of Terminations: 2; Termination: SMD/SMT; Temperature Coefficient: 100ppm/°C; Voltage Rating (DC): 50V; Features: Moisture Resistant; Series: RC; Construction: Rectangular; Length: 1mm; Width: 0.02inch; Height: 0.016inch; Depth: 0.5mm; Military Standard: Not; Lead Free: Lead Free; RoHS Compliant: Yes; ComponentLink1URL: https://datasheet.ciiva.com/12561/pyu-rc0402-51-rohs-l-6-r-8721-12561757.pdf?src-supplier=Mouser; ComponentLink1Description: https://datasheet.ciiva.com/12561/pyu-rc0402-51-rohs-l-6-r-8721-12561757.pdf?src-supplier=Mouser; ComponentLink2URL: https://datasheet.ciiva.com/17073/pyu-rc0402-51-rohs-l-6-r-17073310.pdf?src-supplier=Future+Electronics; ComponentLink2Description: https://datasheet.ciiva.com/17073/pyu-rc0402-51-rohs-l-6-r-17073310.pdf?src-supplier=Future+Electronics; Supplier Part Number 1: YAG3003CT-ND
R9 = RC0603FR-0715K8L: Res Thick Film 0603 15.8K Ohm 1% 0.1W(1/10W) ±100ppm/C Pad SMD T/R; Manufacturer: Yageo; Resistance: 15.8kR; Power Rating: 100mW; Temperature Coefficient: 100ppm/°C; Voltage Rating (DC): 50V; Supplier 1: Digi-Key; Manufacturer Part Number: RC0603FR-0715K8L; RoHS: Yes; Category: Chip SMD Resistors; Stock 1: 458248; Pricing 1: 1=0.10000, 10=0.02100, 100=0.00850, 1000=0.00383, 2500=0.00332 (USD); Case/Package: 0603; Case Code (Metric): 1608; Case Code (Imperial): 0603; Size Code: 0603; Min Operating Temperature: -55°C; Max Operating Temperature: 155°C; Tolerance: 1%; Packaging: Tape and Reel; Resistor Type: Thick Film; Number of Terminations: 2; Max Power Dissipation: 100mW; Features: Moisture Resistant; Series: RC; Construction: Rectangular; Package Quantity: 1; Length: 1.6mm; Width: 0.031inch; Height: 0.022inch; Depth: 0.8mm; Military Standard: Not; Lead Free: Lead Free; RoHS Compliant: Yes; ComponentLink1URL: https://datasheet.ciiva.com/2454/pyu-r-int-thick-7-2454289.pdf?src-supplier=Digi-Key; ComponentLink1Description: https://datasheet.ciiva.com/2454/pyu-r-int-thick-7-2454289.pdf?src-supplier=Digi-Key; ComponentLink2URL: https://datasheet.ciiva.com/2454/pyu-r-int-thick-7-2454290.pdf?src-supplier=Digi-Key; ComponentLink2Description: https://datasheet.ciiva.com/2454/pyu-r-int-thick-7-2454290.pdf?src-supplier=Digi-Key; ComponentLink3URL: https://datasheet.ciiva.com/2454/pyu-r-int-thick-7-2454288.pdf?src-supplier=Digi-Key; ComponentLink3Description: https://datasheet.ciiva.com/2454/pyu-r-int-thick-7-2454288.pdf?src-supplier=Digi-Key; ComponentLink4URL: https://datasheet.ciiva.com/15189/getdatasheetpartid-323764-15189612.pdf?src-supplier=Verical; ComponentLink4Description: https://datasheet.ciiva.com/15189/getdatasheetpartid-323764-15189612.pdf?src-supplier=Verical; Supplier Part Number 1: 311-15.8KHRCT-ND
R10 R20 = RC0402FR-0742K2L: Res Thick Film 0402 42.2K Ohm 1% 0.063W(1/16W) ±100ppm/°C Pad SMD T/R; Manufacturer: Yageo; Resistance: 42.2kR; Power Rating: 62.5mW; Voltage Rating: 50V; Max Power Dissipation: 63mW; Supplier 1: Digi-Key; Manufacturer Part Number: RC0402FR-0742K2L; RoHS: Yes; Category: Chip SMD Resistors; Stock 1: 308521; Pricing 1: 1=0.10000, 10=0.01400, 100=0.00580, 1000=0.00262, 2500=0.00228, 5000=0.00188 (USD); Case/Package: 0402; Case Code (Metric): 1005; Case Code (Imperial): 0402; Contact Plating: Tin,Matte; Size Code: 0402; Min Operating Temperature: -55°C; Max Operating Temperature: 155°C; Tolerance: 1%; Packaging: Tape and Reel; Package Quantity: 1; Resistor Type: Thick Film; Number of Terminations: 2; Termination: SMD/SMT; Temperature Coefficient: 100ppm/°C; Voltage Rating (DC): 50V; Features: Moisture Resistant; Series: RC; Construction: Rectangular; Length: 1mm; Width: 0.02inch; Height: 0.016inch; Depth: 0.5mm; Military Standard: Not; Lead Free: Lead Free; RoHS Compliant: Yes; ComponentLink1URL: https://datasheet.ciiva.com/2453/pyu-r-int-thick-7-2453623.pdf?src-supplier=Digi-Key; ComponentLink1Description: https://datasheet.ciiva.com/2453/pyu-r-int-thick-7-2453623.pdf?src-supplier=Digi-Key; ComponentLink2URL: https://datasheet.ciiva.com/2453/pyu-r-int-thick-7-2453624.pdf?src-supplier=Digi-Key; ComponentLink2Description: https://datasheet.ciiva.com/2453/pyu-r-int-thick-7-2453624.pdf?src-supplier=Digi-Key; ComponentLink3URL: https://datasheet.ciiva.com/2453/pyu-r-int-thick-7-2453622.pdf?src-supplier=Digi-Key; ComponentLink3Description: https://datasheet.ciiva.com/2453/pyu-r-int-thick-7-2453622.pdf?src-supplier=Digi-Key; ComponentLink4URL: https://datasheet.ciiva.com/26830/getdatasheetpartid-326458-26830101.pdf?src-supplier=Verical; ComponentLink4Description: https://datasheet.ciiva.com/26830/getdatasheetpartid-326458-26830101.pdf?src-supplier=Verical; ComponentLink5URL: https://datasheet.ciiva.com/8889/pyu-rc0402-51-rohs-l-6-8889199.pdf?src-supplier=Avnet; ComponentLink5Description: https://datasheet.ciiva.com/8889/pyu-rc0402-51-rohs-l-6-8889199.pdf?src-supplier=Avnet; Supplier Part Number 1: 311-42.2KLRCT-ND